# Altium schematic sheet Voeding.SchDoc
size A4; SheetNumber: 2; SheetTotal: 4
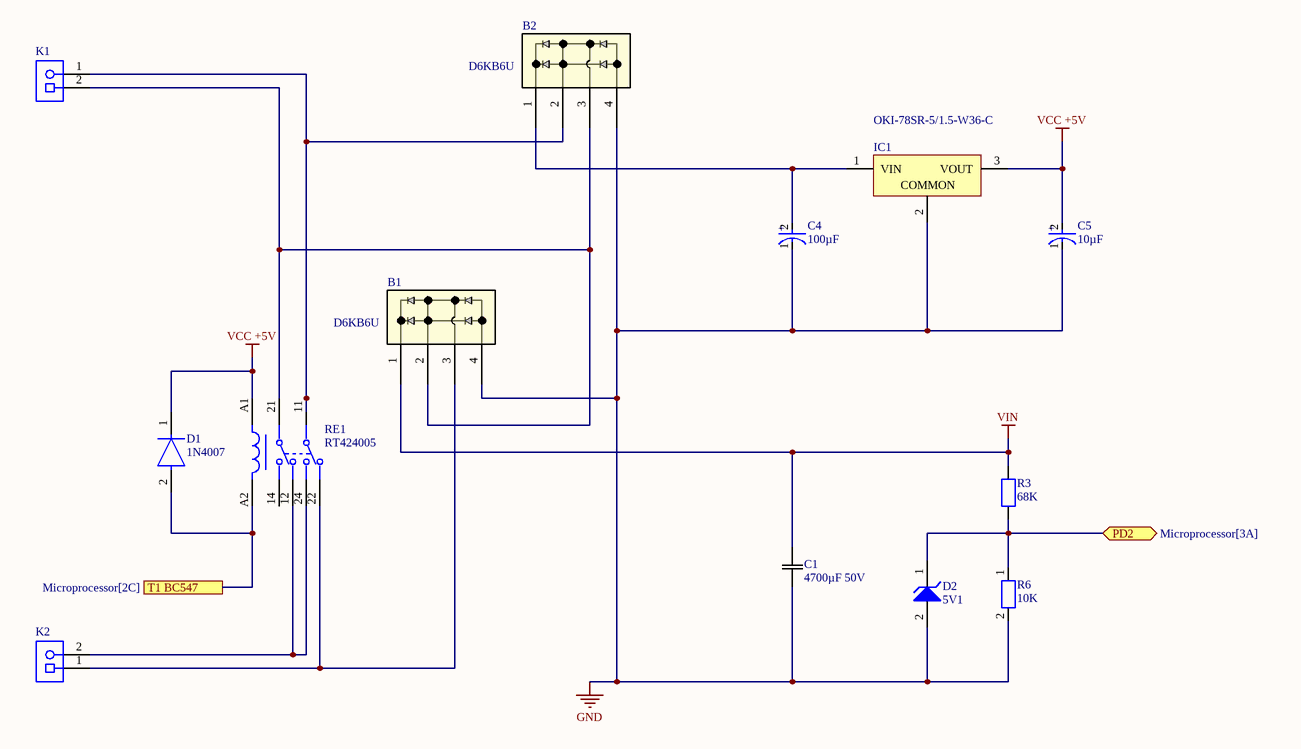
[diagram p0: Voeding.SchDoc]

## Parts
B1  D6KB6U  [SIP4_D6K_MTC]
B2  D6KB6U  [SIP4_D6K_MTC]
C1  4700µF 50V  [CAP_Condensator_22X41]
C4  100µF  [Cap 50V 100µF 8X11]
C5  10µF  [cap 10µF 50V]
D1  1N4007  [1N4007]
D2  5V1  [1N4007]
IC1  OKI-78SR-5/1.5-W36-C  [IC1]
K1  1729128  [2pin connector]  (value not drawn)
K2  1729128  [2pin connector]  (value not drawn)
R3  68K  [Weerstand 1M ohm]
R6  10K  [Weerstand 1M ohm]
RE1  RT424005  [Vermogenrelais]

## Ports
PD2 (bidir, see Microprocessor[3A]), T1 BC547 (see Microprocessor[2C])

## Nets
GND: B1.4 B2.4 C1.1 C4.1(C) C5.1(C) D2.2(A) IC1.2(COMMON) R6.2
VCC +5V: C5.2(A) D1.1(C) IC1.3(VOUT) RE1.A1
VIN: B1.1 C1.2 R3.1
PD2: D2.1(K) R3.2 R6.1 ; port PD2
T1 BC547: D1.2(A) RE1.A2 ; port T1 BC547
NetB1_2: B1.2 B2.3 K1.2 RE1.21
NetB1_3: B1.3 K2.1 RE1.22
NetB2_1: B2.1 C4.2(A) IC1.1(VIN)
NetB2_2: B2.2 K1.1 RE1.11
NetK2_2: K2.2 RE1.12 RE1.24

Not connected (* = marked no-connect by the designer): RE1 14

## Notes on the sheet
- (in symbol 10µF 50V) +
- (in symbol Cap 50V 100µF 8x11) +

## Library data of the parts
B1 B2 = D6KB6U: No Description Available; Mfr_Name: Multicomp; Copyright: Copyright (C) 2023 Ultra Librarian. All rights reserved.; Manufacturer_Part_Number: D6KB6U; RefDes: RefDes; Type: DEV
C1 = 4700µF 50V 22X40: 22x40; Mfr_Name: Panasonic; Manufacturer_Part_Number: EETHC1H472HJ; Type: DEV; Copyright: Copyright (C) 2023 Ultra Librarian. All rights reserved.; RefDes: RefDes
C4 = Cap 50V 100µF 8x11: Aluminum Electrolytic Capacitors (Radial Lead Type) AEC-Q200 Qualified 100uF ±20% 50V; Ripple Current (AC): 180mA; Polarity: Polar; Lead Diameter: 0.6mm; Life (Hours): 1000Hour; Lead/Base Style: Straight; Voltage Rating: 50V; Number of Pins: 2; Mount: Through Hole; Height: 11.5mm; Capacitance: 100uF; Packaging: Bulk; Diameter: 8mm; Min Operating Temperature: -55°C; Max Operating Temperature: 105°C; Case/Package: Radial; Lead Pitch: 3.5mm; Termination: Radial; Voltage: 50V; Package Quantity: 200; Construction: RADIAL; RoHS Compliant: Yes; Ripple Current: 180mA; Voltage Rating (DC): 50V; Series: HD; Tolerance: 20%; Length: 11.5mm; REACH SVHC: No SVHC; Height - Seated (Max): 0.512inch
C5 = 10µF 50V: Aluminum Electrolytic Capacitors (Radial Lead Type) 10uF ±20% 50V; Lead Diameter: 0.5mm; Life (Hours): 5000Hour; Impedance: 340mR; Ripple Current (AC): 250mA; REACH SVHC: Yes; Tolerance: 20%; Construction: RADIAL; Min Operating Temperature: -40°C; Termination: Radial; Voltage Rating: 50V; Height: 11mm; Max Operating Temperature: 105°C; Capacitance: 10uF; Voltage: 50V; Diameter: 5mm; Lead Pitch: 2mm; Series: FR Radial; RoHS Compliant: Yes; Case/Package: Radial
D1 = 1N4007: Rectifier diode 1000 V 1 A DO-41, ,; Manufacturer: Diotec; Max Surge Forward Current: 27A; Forward Current: 1A; Max Junction Temp: +175°C; Reverse Voltage: 1000V; Value: 15pF; Peak Reverse Current: 5uA; Category: Diode; Temperature Range Low: -50°C; Automotive: No; Temperature: -50°C to +175°C; Lead Free: Yes; ComponentLink2Description: Datasheet; Max Repetitive Reverse Voltage: 1000V; ComponentLink2URL: https://datasheet.octopart.com/1N4007-Diotec-datasheet-62346875.pdf; Manufacturer Part Number: 1N4007; Device Class L3: Rectifier Diodes; Height: 2.8mm; Octopart: https://octopart.com/1n4007-diotec-4040411; Package: 1N4007; Temperature Range High: +175°C; Device Class L1: Discrete Semiconductors; Device Class L2: Diodes; RoHS: TRUE; Capacitance: 15pF; Ipc Land Pattern Name: DIOAD888W100L520D280
D2 = Zenerdiode: Zener Voltage Regulator, 500 mW, 2-Pin SOD-123, Pb-Free, Tape and Reel; PartNumber: MMSZ4689T1G; Manufacturer: On Semiconductor; VZ Typ (V): 5.1; P Max (W): 0.5; ComponentLink2URL: http://www.onsemi.com/pub_link/Collateral/MMSZ4678T1-D.PDF; PackageVersion: Rev. G, 10/2009; ComponentLink1Description: Manufacturer URL; PackageDescription: 2-Pin SOD, Body 1.6 x 2.69 mm; DatasheetVersion: Rev. 9; PackageReference: SOD-123-2-425-04; RoHS: Pb-Free; Mounting Technology: Surface Mount; ComponentLink3URL: http://www.onsemi.com/pub_link/Collateral/425-04.PDF; ComponentLink2Description: Datasheet; ComponentLink1URL: http://www.onsemi.com/; ComponentLink3Description: Package Specification; Packing: Tape and Reel
IC1 = IC1: Non-Isolated DC/DC Converter, 7.5 W, 7 to 36 V, 1.5 A, -40 to 85 degC, 3-Pin THD, RoHS; Manufacturer: Murata; Current - Output (Max): 1.5A; Power (Watts) - Max: 8W; Efficiency: 90.5%; Voltage - Input (Min): 7V; Voltage - Input (Max): 36V; Voltage - Output 1: 5V; Number of Outputs: 1; Package / Case: 3-SIPModule; Features: SCP; Type: LinearRegulatorReplacement; Size / Dimension: 0.41"Lx0.30"Wx0.65"H(10.4mmx7.6mmx16.5mm); Datasheet URL: https://datasheet.ciiva.com/8006/1790439-8006672.pdf; Datasheet Version: Oct-13; Power (Watts) - Manufacture Series: 8W; Voltage - Output 2: -; Series: Okami™OKI-78SR; Family: DCDCConverters; Manufacturer URL: http://www.murata.com/; Category: PowerSupplies-BoardMount; Voltage - Isolation: -; Packaging: Tube; Applications: ITE(Commercial); Mounting Type: ThroughHole; Voltage - Output 3: -; Operating Temperature: -40degC~85degC
K1 K2 = 2pin connector: PCB Terminal Block, 13.5 A, 400 V, 2-Pin THD, RoHS, Bulk; Manufacturer: Phoenix Contact; Package Version: 03/2015; No. of Rows: 1; Pitch: 5.08mm; No. of Positions: 2; Voltage Rating: 400V; Current Rating: 13500mA; Manufacturer URL: http://www.phoenixcontact.com/; Datasheet URL: https://datasheet.ciiva.com/16046/1729128-16046181.pdf; RoHS: TRUE; Package URL: https://www.phoenixcontact.com/online/portal/pi/pxc/product_detail_page/!ut/p/b1/3VdJjqNKFDxLH8AFycySyWY2ozFsEPOMMQaDOX1XedGL_1Vdm5YXJleknhSKeBkvI6EA8ncAo3AYoDhBQGco6KN7VURTdemj9us_IEKEZo_YHiPAEWEFmDGOHMORkqKYCORBZxgL7ZoaZYcbFFUZ3fqxSY6GOuxydWUuHqz1ynmMFygu583Bob0Ewr6Sd_l-5m-kAueHiB0jpRwZwe58wwtkpxtMYd_LmGcDRU02dRNEyWt6Y2ti5pSyJ_reIkzIulrqApdnbT11V5jnCKbYNCvhEM1MCpPByat_X379-iThf08CI5GfOPqfBeS3BRoBOdD55AKVv0iLwCMq-2BrzXWSGRH7pUGD9uwXQjiph3xL0DKQwdGa0JImiIOmBNOestqgwTHSSs2oOep-78apyXQBvNi8ZLaFjvjWvcaUEBu0MC6Wbe-d6mB0FAebo2lUWinqYaZs5DAYzV0RP9yitUjnGJ0iI9xhZkT42OCQNUJJhkgWINNQLP2JFP6OpMg3JCVg70jqHT0lvKOnhHf0lPuOnnLf0VPuWx6_dxwUIvwk5WMkT0kLL1mh61l2yZVSzG3pYV_bqo-mj6uMKwKwdnnW8Jh5RTOJzMOA5c-eJDaZQw4mTMPH02PvS_ZAqNVjVTo2WyYLkwH_KU1mmmG5kjRhDqPXLwwVHvVOjCM60-fpXvTDfMGW1PVFVS1r4e4yVDk4ZdNbkUHvqPqQSeian4UD39fNKmachqdJ1NJbyk8rXT9mXTvPk3oE5meulKGgiruPJek-4I9hTT6G8ZLOyRSm2RRVbThERQad5OS28hdt4YW4vG0stgYYzsWsK4_7y6DZMjJSCqri1kyiZR5vD7pwIrNR7QwPHTcLTI5qT7eRlpHrdGiupYlqQDJ7zy_CND8fWWBoLRXxk1RVcXiBQwbTD4Xi7KL-FuO94t9xaqweXzH; PartNumber: 1729128; Package Description: 2-Pin Through Hole Device, Body 8.1 x 10.16 mm, Pitch 5.08 mm; Datasheet Version: 12/2013; Mounting Technology: ThroughHole; Orientation: Horizontal; Package Reference: 1729128-2; Packing: Bulk
R3 = Weerstand 68k ohm: Manufacturer: Vishay Dale; Part Number: CRCW080568K0FKEA
R6 = Weerstand 10K ohm: RES Thick Film, 10kΩ, 1%, 0.125W, 100ppm/°C, 0805; Resistance: 10kR; Voltage Rating (DC): 150V; Power Rating: 125mW; Weight: 0.000194oz; Package Quantity: 5000; Military Standard: Not; Max Operating Temperature: 155°C; Temperature Coefficient: 100ppm/°C; Contact Plating: Tin; Width: 1.25mm; Height: 0.45mm; Radiation Hardening: No; Tolerance: 1%; Min Operating Temperature: -55°C; Voltage Rating: 150V; Length: 2mm; Depth: 1.25mm; Termination: SMD/SMT; Packaging: Tape and Reel; Case/Package: 0805; Case Code (Metric): 2012; Lead Free: Lead Free; Case Code (Imperial): 0805; Composition: Thick Film
RE1 = Vermogenrelais: RELAY GENERAL PURPOSE DPDT 8A 5V; Manufacturer: TE Connectivity; Coil Power: 403mW; Number Of Contacts: 2; Coil Resistance: 62Ω; Coil Type: Non-Latching; Manufacturer Part Number: RT424005; Category: Relay; Octopart: https://octopart.com/5-1393243-9-te+connectivity-41835766; Device Class L3: Power Relays; ComponentLink2URL: https://www.te.com/commerce/DocumentDelivery/DDEController?Action=showdoc&DocId=Data+Sheet%7FRT2%7F1014%7Fpdf%7FEnglish%7FENG_DS_RT2_1014.pdf%7F5-1393243-9; Ambient Temperature Range High: +85°C; ComponentLink2Description: Datasheet; Throw Configuration: DPDT; Digikey Description: RELAY GENERAL PURPOSE DPDT 8A 5V; Package: RT424005; Automotive: No; Device Class L1: Electromechanical; Height: 15.7mm; Device Class L2: Relays; Ambient Temperature Range Low: -40°C; Coil Voltage: 5V; Current Rating: 8A; Mouser Description: General Purpose Relay, Rt2 Series, Power, Non Latching, Dpdt, 5 Vdc, 8 A Rohs Compliant: Yes; Lead Free: Yes; RoHS: TRUE